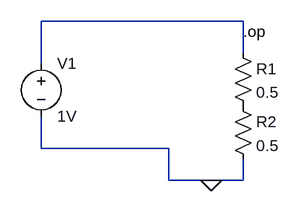
[diagram p0: schematic Vsource_seriesR.asc]
Vsource_seriesR.asc, the LTspice schematic file:
Version 4
SHEET 1 880 680
WIRE 336 208 32 208
WIRE 336 256 336 208
WIRE 32 272 32 208
WIRE 32 400 32 352
WIRE 224 400 32 400
WIRE 224 448 224 400
WIRE 288 448 224 448
WIRE 336 448 336 416
WIRE 336 448 288 448
FLAG 288 448 0
SYMBOL voltage 32 256 R0
SYMATTR InstName V1
SYMATTR Value 1V
SYMBOL res 320 240 R0
SYMATTR InstName R1
SYMATTR Value 0.5
SYMBOL res 320 320 R0
SYMATTR InstName R2
SYMATTR Value 0.5
TEXT 336 224 Left 2 !.op

The netlist it stands for:
* Vsource_seriesR.asc
V1 N001 0 1V
R1 N001 P001 0.5
R2 P001 0 0.5
.op
.backanno
.end